# EAGLE schematic CAN-WiFi-GW-IntBoard (EAGLE 9.6.2)
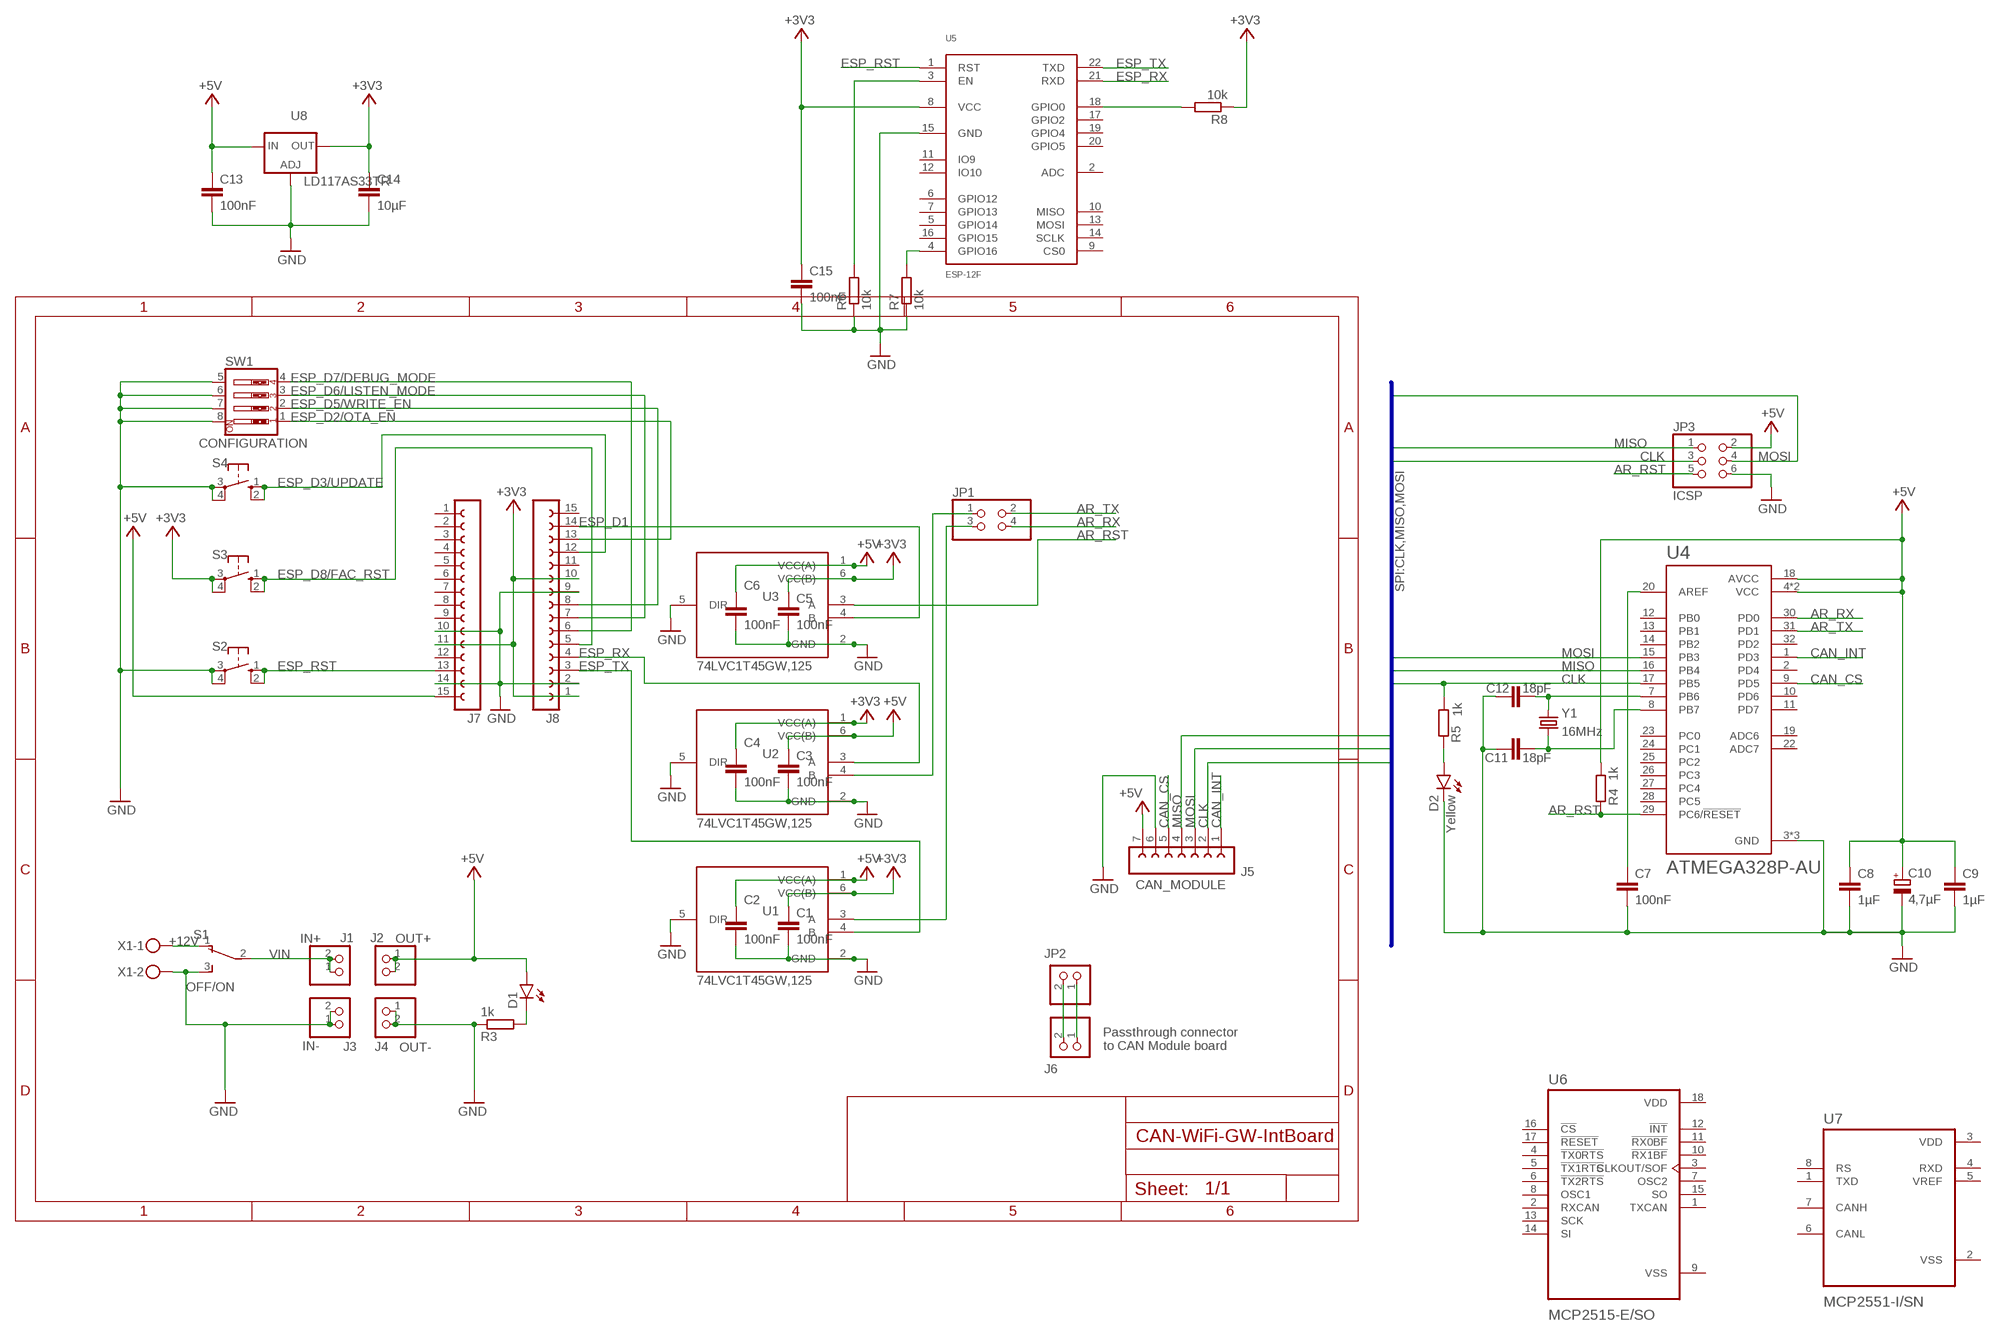
[diagram p0: schematic, sheet 1]

## Parts
C1  100nF  C-EUC1206  [C1206]
C2  100nF  C-EUC1206  [C1206]
C3  100nF  C-EUC1206  [C1206]
C4  100nF  C-EUC1206  [C1206]
C5  100nF  C-EUC1206  [C1206]
C6  100nF  C-EUC1206  [C1206]
C7  100nF  C-EUC1206  [C1206]
C8  1µF  C-EUC1206  [C1206]
C9  1µF  C-EUC1206  [C1206]
C10  4,7µF  CPOL-EUSMCC  [SMC_C]
C11  18pF  C-EUC1206  [C1206]
C12  18pF  C-EUC1206  [C1206]
C13  100nF  C-EUC1206  [C1206]
C14  10µF  C-EUC1206  [C1206]
C15  100nF  C-EUC1206  [C1206]
D1  LEDSML0805  [SML0805]
D2  Yellow  LEDSML0805  [SML0805]
J1  IN+  PINHD-1X2  [1X02]
J2  OUT+  PINHD-1X2  [1X02]
J3  IN-  PINHD-1X2  [1X02]
J4  OUT-  PINHD-1X2  [1X02]
J5  CAN_MODULE  FE07-1  [FE07]
J6  PINHD-1X2  [1X02]
J7  FE15-1  [FE15]
J8  FE15-1  [FE15]
JP1  PINHD-2X2  [2X02]
JP2  PINHD-1X2  [1X02]
JP3  ICSP  PINHD-2X3  [2X03]
R3  1k  R-EU_R0805  [R0805]
R4  1k  R-EU_R0805  [R0805]
R5  1k  R-EU_R0805  [R0805]
R6  10k  R-EU_R1206  [R1206]
R7  10k  R-EU_R1206  [R1206]
R8  10k  R-EU_R1206  [R1206]
S1  OFF/ON  TL36PO  [TL3XPO]
S2  10-XX  [B3F-10XX]
S3  10-XX  [B3F-10XX]
S4  10-XX  [B3F-10XX]
SW1  CONFIGURATION  SW_DIP-4  [EDG-04]
U1  74LVC1T45GW,125  [SOP65P210X110-6N]
U2  74LVC1T45GW,125  [SOP65P210X110-6N]
U3  74LVC1T45GW,125  [SOP65P210X110-6N]
U4  ATMEGA328P-AU  [QFP80P900X900X120-32N]
U5  ESP-12F  [ESP-12F]
U6  MCP2515-E/SO  [SOIC127P1030X265-18N]
U7  MCP2551-I/SN  [SOIC127P599X175-8N]
U8  LD117AS33TR  [SOT223]
X1  MKDSN1,5/2-5,08  [MKDSN1,5/2-5,08]
Y1  16MHz  CRYSTALHC49S  [HC49/S]

## Nets
+3V3: C1.1 C4.1 C5.1 C14.1 C15.1 J7.11 J8.1 J8.10 R8.1 S3.3(P) S3.4(P1) U1.6(VCC(B)) U2.1(VCC(A)) U3.6(VCC(B)) U5.8(VCC) U8.4(OUT)
+5V: C2.1 C3.1 C6.1 C8.1 C9.1 C10.+ C13.1 D1.A J2.1 J2.2 J5.7 J7.15 JP3.2 R4.1 U1.1(VCC(A)) U2.6(VCC(B)) U3.1(VCC(A)) U4.4(VCC) U4.6(VCC) U4.18(AVCC) U8.3(IN)
+12V: S1.1(O) X1.1
AR_RST: JP3.5 R4.2 U3.3(A) U4.29(PC6/!RESET)
AR_RX: JP1.4 U4.30(PD0)
AR_TX: JP1.2 U4.31(PD1)
CAN_CS: J5.5 U4.9(PD5)
CAN_INT: J5.1 U4.1(PD3)
CLK: J5.2 JP3.3 R5.2 U4.17(PB5)
ESP_D1: J8.14 U3.4(B)
ESP_D2/OTA_EN: J8.13 SW1.1
ESP_D3/UPDATE: J8.12 S4.1(S) S4.2(S1)
ESP_D5/WRITE_EN: J8.8 SW1.2
ESP_D6/LISTEN_MODE: J8.7 SW1.3
ESP_D7/DEBUG_MODE: J8.6 SW1.4
ESP_D8/FAC_RST: J8.5 S3.1(S) S3.2(S1)
ESP_RST: J7.13 S2.1(S) S2.2(S1) U5.1(RST)
ESP_RX: J8.4 U2.3(A) U5.21(RXD)
ESP_RX_5V: JP1.1 U2.4(B)
ESP_TX: J8.3 U1.4(B) U5.22(TXD)
ESP_TX_5V: JP1.3 U1.3(A)
GND: C1.2 C2.2 C3.2 C4.2 C5.2 C6.2 C7.2 C8.2 C9.2 C10.- C11.2 C12.2 C13.2 C14.2 C15.2 D2.C J3.1 J3.2 J4.1 J4.2 J5.6 J7.10 J7.14 J8.2 J8.9 JP3.6 R3.1 R6.1 R7.1 S1.3(S) S2.3(P) S2.4(P1) S4.3(P) S4.4(P1) SW1.5 SW1.6 SW1.7 SW1.8 U1.2(GND) U1.5(DIR) U2.2(GND) U2.5(DIR) U3.2(GND) U3.5(DIR) U4.3(GND) U4.5(GND) U4.21(GND) U5.15(GND) U8.1(ADJ) X1.2
MISO: J5.4 JP3.1 U4.16(PB4)
MOSI: J5.3 JP3.4 U4.15(PB3)
N$1: D1.C R3.2
N$2: J6.1 JP2.1
N$3: J6.2 JP2.2
N$4: C12.1 U4.7(PB6) Y1.2
N$5: C11.1 U4.8(PB7) Y1.1
N$6: C7.1 U4.20(AREF)
N$7: D2.A R5.1
N$8: R6.2 U5.3(EN)
N$9: R8.2 U5.18(GPIO0)
N$10: R7.2 U5.4(GPIO16)
VIN: J1.1 J1.2 S1.2(P)
Unconnected: J7.1 J7.2 J7.3 J7.4 J7.5 J7.6 J7.7 J7.8 J7.9 J7.12 J8.11 J8.15 U4.2(PD4) U4.10(PD6) U4.11(PD7) U4.12(PB0) U4.13(PB1) U4.14(PB2) U4.19(ADC6) U4.22(ADC7) U4.23(PC0) U4.24(PC1) U4.25(PC2) U4.26(PC3) U4.27(PC4) U4.28(PC5) U4.32(PD2) U5.2(ADC) U5.5(GPIO14) U5.6(GPIO12) U5.7(GPIO13) U5.9(CS0) U5.10(MISO) U5.11(IO9) U5.12(IO10) U5.13(MOSI) U5.14(SCLK) U5.16(GPIO15) U5.17(GPIO2) U5.19(GPIO4) U5.20(GPIO5) U6.1(TXCAN) U6.2(RXCAN) U6.3(CLKOUT/SOF) U6.4(!TX0RTS) U6.5(!TX1RTS) U6.6(!TX2RTS) U6.7(OSC2) U6.8(OSC1) U6.10(!RX1BF) U6.11(!RX0BF) U6.12(!INT) U6.13(SCK) U6.14(SI) U6.15(SO) U6.16(!CS) U6.17(!RESET) U7.1(TXD) U7.4(RXD) U7.5(VREF) U7.6(CANL) U7.7(CANH) U7.8(RS)

## Buses
SPI:CLK,MISO,MOSI

## Notes on the sheet
- Passthrough connector
  to CAN Module board

## Power pins joined to a net without a drawn wire
VDD: U6.18(VDD) U7.3(VDD)
VSS: U6.9(VSS) U7.2(VSS)

## Library data of the parts
C1-C9 C11-C15 = rcl:C-EU: CAPACITOR, European symbol; SPICEPREFIX: C
C10 = rcl:CPOL-EU: POLARIZED CAPACITOR, European symbol; SPICEPREFIX: C
D1 D2 = led:LED: LED OSRAM: - CHIPLED LG R971, LG N971, LY N971, LG Q971, LY Q971, LO R971, LY R971 LH N974, LH R974 LS Q976, LO Q976, LY Q976 LO Q996 - Hyper CHIPLED LW Q18S LB Q993, LB Q99A, LB R99A - SideLED LS A670, LO A670, LY A670, LG A670, LP A670 LB A673, LV A673, LT A673, LW A673 LH A674 LY A675 LS A676, LA A676, LO A676, LY A676, LW A676 LS A679, LY A679, LG A679 - Hyper Micro SIDELED® LS Y876, LA Y876, LO Y876, LY Y876 LT Y87S - SmartLED LW L88C, LW L88S LB L89C, LB L89S, LG L890 LS L89K, LO L89K, LY L89K LS L896, LA L896, LO L896, LY L896 - TOPLED LS T670, LO T670, LY T670, LG T670, LP T670 LSG T670, LSP T670, LSY T670, LOP T670, LYG T670 LG T671, LOG T671, LSG T671 LB T673, LV T673, LT T673, LW T673 LH T674 LS T676, LA T676, LO T676, LY T676, LB T676, LH T676, LSB T676, LW T676 LB T67C, LV T67C, LT T67C, LS T67K, LO T67K, LY T67K, LW E67C LS E67B, LA E67B, LO E67B, LY E67B, LB E67C, LV E67C, LT E67C LW T67C LS T679, LY T679, LG T679 LS T770, LO T770, LY T770, LG T770, LP T770 LB T773, LV T773, LT T773, LW T773 LH T774 LS E675, LA E675, LY E675, LS T675 LS T776, LA T776, LO T776, LY T776, LB T776 LHGB T686 LT T68C, LB T68C - Hyper Mini TOPLED® LB M676 - Mini TOPLED Santana® LG M470 LS M47K, LO M47K, LY M47K Source: http://www.osram.convergy.de LUXEON: - LUMILED® LXK2-PW12-R00, LXK2-PW12-S00, LXK2-PW14-U00, LXK2-PW14-V00 LXK2-PM12-R00, LXK2-PM12-S00, LXK2-PM14-U00 LXK2-PE12-Q00, LXK2-PE12-R00, LXK2-PE12-S00, LXK2-PE14-T00, LXK2-PE14-U00 LXK2-PB12-K00, LXK2-PB12-L00, LXK2-PB12-M00, LXK2-PB14-N00, LXK2-PB14-P00, LXK2-PB14-Q00 LXK2-PR12-L00, LXK2-PR12-M00, LXK2-PR14-Q00, LXK2-PR14-R00 LXK2-PD12-Q00, LXK2-PD12-R00, LXK2-PD12-S00 LXK2-PH12-R00, LXK2-PH12-S00 LXK2-PL12-P00, LXK2-PL12-Q00, LXK2-PL12-R00 Source: www.luxeon.com KINGBRIGHT: KA-3528ASYC Source: www.kingbright.com
J1-J4 J6 JP2 = pinhead:PINHD-1X2: PIN HEADER
J5 = con-lsta:FE07-1: FEMALE HEADER; OC_FARNELL: unknown; OC_NEWARK: unknown
J7 J8 = con-lsta:FE15-1: FEMALE HEADER; OC_FARNELL: unknown; OC_NEWARK: unknown
JP1 = pinhead:PINHD-2X2: PIN HEADER
JP3 = pinhead:PINHD-2X3: PIN HEADER
R3-R8 = rcl:R-EU_: RESISTOR, European symbol; SPICEPREFIX: R
S1 = switch:TL36PO: TINY SWITCH ON - ON Source: http://www2.produktinfo.conrad.com/datenblaetter/700000-724999/705152-da-01-de-Subminiaturschalter_TL_36YO.pdf
S2-S4 = switch-omron:10-XX: OMRON SWITCH; MPN: B3F-1000; OC_FARNELL: 176432; OC_NEWARK: 36M3542
SW1 = special:SW_DIP-4: DIP SWITCH
U1-U3 = 74LVC1T45GW_125:74LVC1T45GW,125: Check availability <https://pricing.snapeda.com/parts/74LVC1T45GW%2C125/Nexperia%20USA%20Inc./view-part?ref=eda>; AVAILABILITY: In Stock; DESCRIPTION: Voltage Level Translator Bidirectional 1 Circuit 1 Channel 420Mbps 6-TSSOP; MF: Nexperia USA Inc.; MP: 74LVC1T45GW,125; PACKAGE: None; PRICE: None; PURCHASE-URL: https://pricing.snapeda.com/search/part/74LVC1T45GW,125/?ref=eda
U4 = ATMEGA328P-AU:ATMEGA328P-AU: ATmega Series 20 MHz 32 KB Flash 2 KB SRAM 8-Bit Microcontroller - TQFP-32 Check availability <https://pricing.snapeda.com/parts/ATMEGA328P-AU/Microchip%20Technology/view-part?ref=eda>; AVAILABILITY: In Stock; DESCRIPTION: AVR AVR® ATmega Microcontroller IC 8-Bit 20MHz 32KB (16K x 16) FLASH 32-TQFP (7x7); MF: Microchip Technology; MP: ATMEGA328P-AU; PACKAGE: TQFP-32 Microchip; PRICE: None; PURCHASE-URL: https://pricing.snapeda.com/search/part/ATMEGA328P-AU/?ref=eda
U5 = SnapEDA-Library:ESP-12F: 317060163
U6 = SnapEDA-Library:MCP2515-E/SO
U7 = SnapEDA-Library:MCP2551-I/SN
U8 = v-reg:LD117A?*: Low drop fixed and adjustable positive voltage regulators 1 A Source: http://www.st.com/stonline/products/literature/ds/7194/ld1117axx.pdf
X1 = con-phoenix-508:MKDSN1,5/2-5,08: MKDSN 1,5/ 2-5,08 Printklemme Nennstrom: 13,5 A Nennspannung: 250 V Rastermaß: 5,08 mm Polzahl: 2 Anschlussart: Schraubanschluss Montage: Löten Anschlussrichtung Leiter/Platine: 0 ° Artikelnummer: 1729128 Source: http://eshop.phoenixcontact.com .. 1729128.pdf
Y1 = crystal:CRYSTAL: CRYSTAL; OC_FARNELL: 1667008; OC_NEWARK: unknown

## Net classes
0 default: clearance 0.205 mm